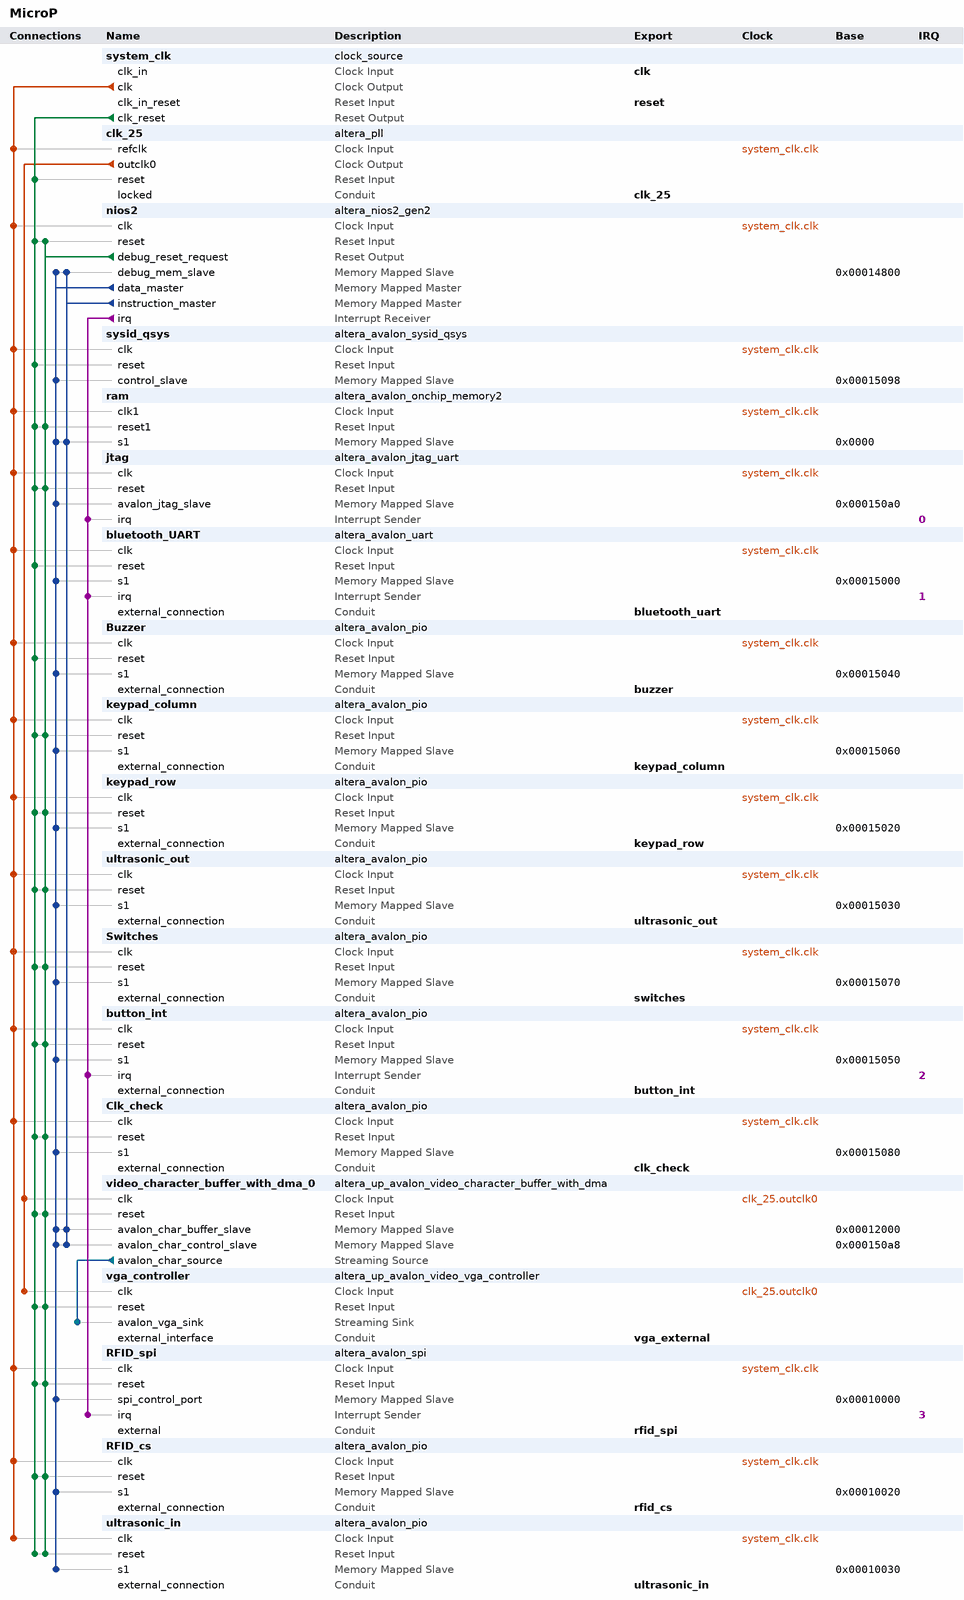
[diagram p0: system contents]
# Platform Designer (Qsys) system MicroP, Cyclone V 5CSEMA5F31C6
# Parameters at their usual value, and those the tool derives, are not listed.
package require -exact qsys 15.0
create_system MicroP
set_project_property DEVICE_FAMILY {Cyclone V}
set_project_property DEVICE 5CSEMA5F31C6

add_instance system_clk clock_source 15.0
set_instance_parameter_value system_clk clockFrequency 50000000

add_instance clk_25 altera_pll 15.0
set_instance_parameter_value clk_25 gui_device_speed_grade 1
set_instance_parameter_value clk_25 gui_number_of_clocks 1
set_instance_parameter_value clk_25 gui_operation_mode direct
set_instance_parameter_value clk_25 gui_output_clock_frequency0 25.0
set_instance_parameter_value clk_25 gui_pll_mode {Integer-N PLL}
set_instance_parameter_value clk_25 gui_reference_clock_frequency 50.0
set_instance_parameter_value clk_25 gui_use_locked true

add_instance nios2 altera_nios2_gen2 15.0
set_instance_parameter_value nios2 dcache_size 2048
set_instance_parameter_value nios2 exceptionSlave ram.s1
set_instance_parameter_value nios2 icache_size 4096
set_instance_parameter_value nios2 impl Tiny
set_instance_parameter_value nios2 resetSlave ram.s1

add_instance sysid_qsys altera_avalon_sysid_qsys 15.0
set_instance_parameter_value sysid_qsys id 0

add_instance ram altera_avalon_onchip_memory2 15.0
set_instance_parameter_value ram dataWidth 32
set_instance_parameter_value ram dualPort false
set_instance_parameter_value ram initMemContent true
set_instance_parameter_value ram initializationFileName onchip_mem.hex
set_instance_parameter_value ram memorySize 64000

add_instance jtag altera_avalon_jtag_uart 15.0
set_instance_parameter_value jtag simInteractiveOptions NO_INTERACTIVE_WINDOWS

add_instance bluetooth_UART altera_avalon_uart 15.0
set_instance_parameter_value bluetooth_UART baud 9600
set_instance_parameter_value bluetooth_UART dataBits 8
set_instance_parameter_value bluetooth_UART fixedBaud true
set_instance_parameter_value bluetooth_UART parity NONE
set_instance_parameter_value bluetooth_UART stopBits 1

add_instance Buzzer altera_avalon_pio 15.0
set_instance_parameter_value Buzzer direction Output
set_instance_parameter_value Buzzer width 1

add_instance keypad_column altera_avalon_pio 15.0
set_instance_parameter_value keypad_column direction Input
set_instance_parameter_value keypad_column width 4

add_instance keypad_row altera_avalon_pio 15.0
set_instance_parameter_value keypad_row direction Output
set_instance_parameter_value keypad_row width 4

add_instance ultrasonic_out altera_avalon_pio 15.0
set_instance_parameter_value ultrasonic_out direction Output
set_instance_parameter_value ultrasonic_out width 1

add_instance Switches altera_avalon_pio 15.0
set_instance_parameter_value Switches direction Input
set_instance_parameter_value Switches width 8

add_instance button_int altera_avalon_pio 15.0
set_instance_parameter_value button_int captureEdge true
set_instance_parameter_value button_int direction Input
set_instance_parameter_value button_int edgeType FALLING
set_instance_parameter_value button_int generateIRQ true
set_instance_parameter_value button_int irqType EDGE
set_instance_parameter_value button_int width 1

add_instance Clk_check altera_avalon_pio 15.0
set_instance_parameter_value Clk_check direction Output
set_instance_parameter_value Clk_check width 1

add_instance video_character_buffer_with_dma_0 altera_up_avalon_video_character_buffer_with_dma 15.0
set_instance_parameter_value video_character_buffer_with_dma_0 enable_transparency false

add_instance vga_controller altera_up_avalon_video_vga_controller 15.0
set_instance_parameter_value vga_controller board DE1-SoC
set_instance_parameter_value vga_controller resolution {VGA 640x480}

add_instance RFID_spi altera_avalon_spi 15.0
set_instance_parameter_value RFID_spi clockPolarity 0
set_instance_parameter_value RFID_spi dataWidth 8
set_instance_parameter_value RFID_spi masterSPI true
set_instance_parameter_value RFID_spi numberOfSlaves 1
set_instance_parameter_value RFID_spi targetClockRate 4000000

add_instance RFID_cs altera_avalon_pio 15.0
set_instance_parameter_value RFID_cs direction Output
set_instance_parameter_value RFID_cs width 1

add_instance ultrasonic_in altera_avalon_pio 15.0
set_instance_parameter_value ultrasonic_in direction Input
set_instance_parameter_value ultrasonic_in width 1

# connections
add_connection clk_25.outclk0 vga_controller.clk clock
add_connection clk_25.outclk0 video_character_buffer_with_dma_0.clk clock
add_connection system_clk.clk bluetooth_UART.clk clock
add_connection system_clk.clk button_int.clk clock
add_connection system_clk.clk Buzzer.clk clock
add_connection system_clk.clk clk_25.refclk clock
add_connection system_clk.clk Clk_check.clk clock
add_connection system_clk.clk jtag.clk clock
add_connection system_clk.clk keypad_column.clk clock
add_connection system_clk.clk keypad_row.clk clock
add_connection system_clk.clk nios2.clk clock
add_connection system_clk.clk ram.clk1 clock
add_connection system_clk.clk RFID_cs.clk clock
add_connection system_clk.clk RFID_spi.clk clock
add_connection system_clk.clk Switches.clk clock
add_connection system_clk.clk sysid_qsys.clk clock
add_connection system_clk.clk ultrasonic_in.clk clock
add_connection system_clk.clk ultrasonic_out.clk clock
add_connection nios2.debug_reset_request button_int.reset reset
add_connection nios2.debug_reset_request Clk_check.reset reset
add_connection nios2.debug_reset_request jtag.reset reset
add_connection nios2.debug_reset_request keypad_column.reset reset
add_connection nios2.debug_reset_request keypad_row.reset reset
add_connection nios2.debug_reset_request nios2.reset reset
add_connection nios2.debug_reset_request ram.reset1 reset
add_connection nios2.debug_reset_request RFID_cs.reset reset
add_connection nios2.debug_reset_request RFID_spi.reset reset
add_connection nios2.debug_reset_request Switches.reset reset
add_connection nios2.debug_reset_request ultrasonic_in.reset reset
add_connection nios2.debug_reset_request ultrasonic_out.reset reset
add_connection nios2.debug_reset_request vga_controller.reset reset
add_connection nios2.debug_reset_request video_character_buffer_with_dma_0.reset reset
add_connection system_clk.clk_reset bluetooth_UART.reset reset
add_connection system_clk.clk_reset button_int.reset reset
add_connection system_clk.clk_reset Buzzer.reset reset
add_connection system_clk.clk_reset clk_25.reset reset
add_connection system_clk.clk_reset Clk_check.reset reset
add_connection system_clk.clk_reset jtag.reset reset
add_connection system_clk.clk_reset keypad_column.reset reset
add_connection system_clk.clk_reset keypad_row.reset reset
add_connection system_clk.clk_reset nios2.reset reset
add_connection system_clk.clk_reset ram.reset1 reset
add_connection system_clk.clk_reset RFID_cs.reset reset
add_connection system_clk.clk_reset RFID_spi.reset reset
add_connection system_clk.clk_reset Switches.reset reset
add_connection system_clk.clk_reset sysid_qsys.reset reset
add_connection system_clk.clk_reset ultrasonic_in.reset reset
add_connection system_clk.clk_reset ultrasonic_out.reset reset
add_connection system_clk.clk_reset vga_controller.reset reset
add_connection system_clk.clk_reset video_character_buffer_with_dma_0.reset reset
add_connection nios2.data_master bluetooth_UART.s1 avalon
set_connection_parameter_value nios2.data_master/bluetooth_UART.s1 baseAddress 0x00015000
add_connection nios2.data_master button_int.s1 avalon
set_connection_parameter_value nios2.data_master/button_int.s1 baseAddress 0x00015050
add_connection nios2.data_master Buzzer.s1 avalon
set_connection_parameter_value nios2.data_master/Buzzer.s1 baseAddress 0x00015040
add_connection nios2.data_master Clk_check.s1 avalon
set_connection_parameter_value nios2.data_master/Clk_check.s1 baseAddress 0x00015080
add_connection nios2.data_master jtag.avalon_jtag_slave avalon
set_connection_parameter_value nios2.data_master/jtag.avalon_jtag_slave baseAddress 0x000150a0
add_connection nios2.data_master keypad_column.s1 avalon
set_connection_parameter_value nios2.data_master/keypad_column.s1 baseAddress 0x00015060
add_connection nios2.data_master keypad_row.s1 avalon
set_connection_parameter_value nios2.data_master/keypad_row.s1 baseAddress 0x00015020
add_connection nios2.data_master nios2.debug_mem_slave avalon
set_connection_parameter_value nios2.data_master/nios2.debug_mem_slave baseAddress 0x00014800
add_connection nios2.data_master ram.s1 avalon
set_connection_parameter_value nios2.data_master/ram.s1 baseAddress 0x0000
add_connection nios2.data_master RFID_cs.s1 avalon
set_connection_parameter_value nios2.data_master/RFID_cs.s1 baseAddress 0x00010020
add_connection nios2.data_master RFID_spi.spi_control_port avalon
set_connection_parameter_value nios2.data_master/RFID_spi.spi_control_port baseAddress 0x00010000
add_connection nios2.data_master Switches.s1 avalon
set_connection_parameter_value nios2.data_master/Switches.s1 baseAddress 0x00015070
add_connection nios2.data_master sysid_qsys.control_slave avalon
set_connection_parameter_value nios2.data_master/sysid_qsys.control_slave baseAddress 0x00015098
add_connection nios2.data_master ultrasonic_in.s1 avalon
set_connection_parameter_value nios2.data_master/ultrasonic_in.s1 baseAddress 0x00010030
add_connection nios2.data_master ultrasonic_out.s1 avalon
set_connection_parameter_value nios2.data_master/ultrasonic_out.s1 baseAddress 0x00015030
add_connection nios2.data_master video_character_buffer_with_dma_0.avalon_char_buffer_slave avalon
set_connection_parameter_value nios2.data_master/video_character_buffer_with_dma_0.avalon_char_buffer_slave baseAddress 0x00012000
add_connection nios2.data_master video_character_buffer_with_dma_0.avalon_char_control_slave avalon
set_connection_parameter_value nios2.data_master/video_character_buffer_with_dma_0.avalon_char_control_slave baseAddress 0x000150a8
add_connection nios2.instruction_master nios2.debug_mem_slave avalon
set_connection_parameter_value nios2.instruction_master/nios2.debug_mem_slave baseAddress 0x00014800
add_connection nios2.instruction_master ram.s1 avalon
set_connection_parameter_value nios2.instruction_master/ram.s1 baseAddress 0x0000
add_connection nios2.instruction_master video_character_buffer_with_dma_0.avalon_char_buffer_slave avalon
set_connection_parameter_value nios2.instruction_master/video_character_buffer_with_dma_0.avalon_char_buffer_slave baseAddress 0x00012000
add_connection nios2.instruction_master video_character_buffer_with_dma_0.avalon_char_control_slave avalon
set_connection_parameter_value nios2.instruction_master/video_character_buffer_with_dma_0.avalon_char_control_slave baseAddress 0x000150a8
add_connection video_character_buffer_with_dma_0.avalon_char_source vga_controller.avalon_vga_sink avalon_streaming
add_connection nios2.irq bluetooth_UART.irq interrupt
set_connection_parameter_value nios2.irq/bluetooth_UART.irq irqNumber 1
add_connection nios2.irq button_int.irq interrupt
set_connection_parameter_value nios2.irq/button_int.irq irqNumber 2
add_connection nios2.irq jtag.irq interrupt
set_connection_parameter_value nios2.irq/jtag.irq irqNumber 0
add_connection nios2.irq RFID_spi.irq interrupt
set_connection_parameter_value nios2.irq/RFID_spi.irq irqNumber 3

# exported interfaces
add_interface bluetooth_uart conduit end
set_interface_property bluetooth_uart EXPORT_OF bluetooth_UART.external_connection
add_interface button_int conduit end
set_interface_property button_int EXPORT_OF button_int.external_connection
add_interface buzzer conduit end
set_interface_property buzzer EXPORT_OF Buzzer.external_connection
add_interface clk clock sink
set_interface_property clk EXPORT_OF system_clk.clk_in
add_interface clk_25 conduit end
set_interface_property clk_25 EXPORT_OF clk_25.locked
add_interface clk_check conduit end
set_interface_property clk_check EXPORT_OF Clk_check.external_connection
add_interface keypad_column conduit end
set_interface_property keypad_column EXPORT_OF keypad_column.external_connection
add_interface keypad_row conduit end
set_interface_property keypad_row EXPORT_OF keypad_row.external_connection
add_interface reset reset sink
set_interface_property reset EXPORT_OF system_clk.clk_in_reset
add_interface rfid_cs conduit end
set_interface_property rfid_cs EXPORT_OF RFID_cs.external_connection
add_interface rfid_spi conduit end
set_interface_property rfid_spi EXPORT_OF RFID_spi.external
add_interface switches conduit end
set_interface_property switches EXPORT_OF Switches.external_connection
add_interface ultrasonic_in conduit end
set_interface_property ultrasonic_in EXPORT_OF ultrasonic_in.external_connection
add_interface ultrasonic_out conduit end
set_interface_property ultrasonic_out EXPORT_OF ultrasonic_out.external_connection
add_interface vga_external conduit end
set_interface_property vga_external EXPORT_OF vga_controller.external_interface

set_interconnect_requirement {$system} qsys_mm.clockCrossingAdapter HANDSHAKE
set_interconnect_requirement {$system} qsys_mm.enableEccProtection FALSE
set_interconnect_requirement {$system} qsys_mm.insertDefaultSlave FALSE
set_interconnect_requirement {$system} qsys_mm.maxAdditionalLatency 1

save_system MicroP.qsys
